# Altium schematic sheet regulater.SchDoc
size A; SheetNumber: 1; SheetTotal: 1
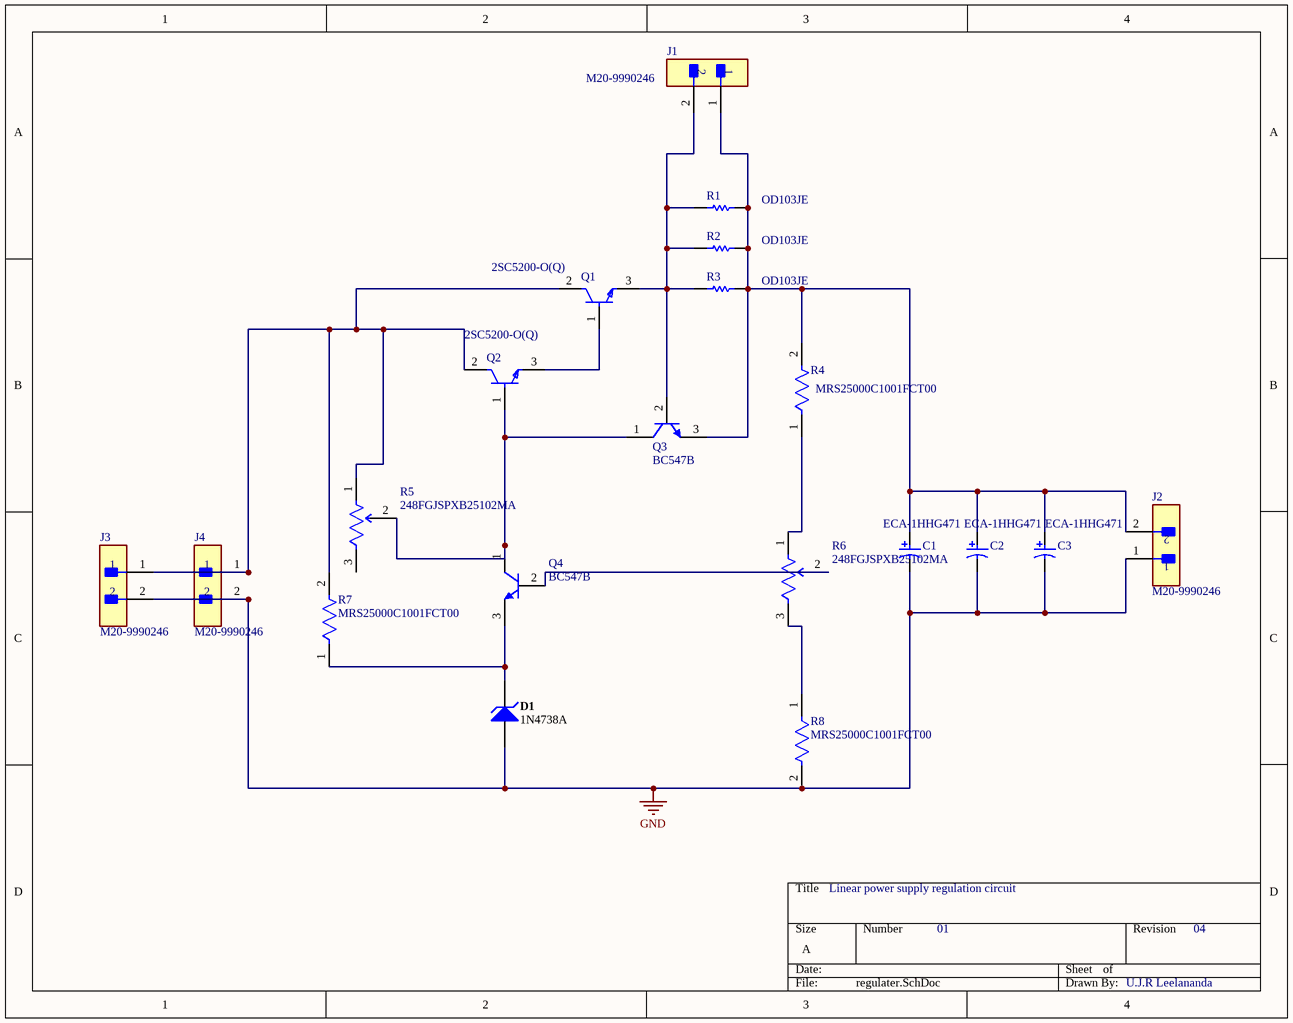
[diagram p0: regulater.SchDoc]

## Parts
C1  ECA-1HHG471  [PNSC-CAP-10x20-P2]
C2  ECA-1HHG471  [PNSC-CAP-10x20-P2]
C3  ECA-1HHG471  [PNSC-CAP-10x20-P2]
D1  1N4738A  [FAIR-DO-41-2_V]
J1  M20-9990246  [FP-M20-9990246-MFG]
J2  M20-9990246  [FP-M20-9990246-MFG]
J3  M20-9990246  [FP-M20-9990246-MFG]
J4  M20-9990246  [FP-M20-9990246-MFG]
Q1  2SC5200-O(Q)  [FP-2-21F1A-MFG]
Q2  2SC5200-O(Q)  [FP-2-21F1A-MFG]
Q3  BC547B  [ONSC-TO-92-3-29-11]
Q4  BC547B  [ONSC-TO-92-3-29-11]
R1  OD103JE  [OMTE-RES7X2.5-2]
R2  OD103JE  [OMTE-RES7X2.5-2]
R3  OD103JE  [OMTE-RES7X2.5-2]
R4  MRS25000C1001FCT00  [FP-MRS25-MFG]
R5  248FGJSPXB25102MA  [FP-248FGJSPXB25102MA-MFG]
R6  248FGJSPXB25102MA  [FP-248FGJSPXB25102MA-MFG]
R7  MRS25000C1001FCT00  [FP-MRS25-MFG]
R8  MRS25000C1001FCT00  [FP-MRS25-MFG]

## Nets
GND: C1.2 C2.2 C3.2 D1.1(A) J2.1 J3.2 J4.2 R8.2
NetC1_1: C1.1 C2.1 C3.1 J1.1 J2.2 Q3.3(E) R1.2 R2.2 R3.2 R4.2
NetD1_2: D1.2(K) Q4.3(E) R7.1
NetJ1_2: J1.2 Q1.3(E) Q3.2(B) R1.1 R2.1 R3.1
NetJ3_1: J3.1 J4.1 Q1.2(C) Q2.2(C) R5.1 R7.2
NetQ1_1: Q1.1(B) Q2.3(E)
NetQ2_1: Q2.1(B) Q3.1(C) Q4.1(C) R5.2(CW)
NetQ4_2: Q4.2(B) R6.2(CW)
NetR4_1: R4.1 R6.1
NetR6_3: R6.3 R8.1

Not connected (* = marked no-connect by the designer): R5 3

## Notes on the sheet
- Linear power supply regulation circuit
- 01
- 04
- U.J.R Leelananda

## Library data of the parts
C1-C3 = CMP-2000-05308-1: Aluminum Electrolytic Capacitor, 470 uF, +/- 20%, 50 V, -55 to 105 degC, 2-Pin THD, RoHS, Bulk; Manufacturer: Panasonic; Package Version: Nov-12; Type: Radial; Lifetime@Temperature: 2000Hrs@105degC; Capacitance: 470µF; Rated Voltage: 50V; Ripple Current: 530mA; Case Size/Dimension: Ø10x20mm; Package Reference: CAP-10x20-P2; Package Description: 2-Pin Through Hole Device, Dia 10 mm, Body Length 20 mm, Pin Spacing 5 mm; Series: NHG; Datasheet Version: Nov-12; Datasheet URL: http://www.alliedelec.com/images/products/datasheets/bm/Panasonic/70067776.pdf; Package URL: http://www.alliedelec.com/images/products/datasheets/bm/Panasonic/70067776.pdf; Operating Temp-Max: 105degC; Operating Temp Range: -55to+105degC; Manufacturer URL: http://www.panasonic.com/
D1 = CMP-0892-00011-1: Zener Diode, 8.2V, 1W, 5%, -65 to 200 degC, 2-Pin DO-41, Body 2.72 x 5.2 mm, RoHS; Manufacturer: Fairchild Semiconductor; VZ (Max.) (V): 8.61; ZZ (Max) (ohm): 4; Test Current IZ (mA): 31; VZ (Min.) (V): 7.79; PD (W): 1; IR (uA): 10; Tolerance: 5%; DatasheetVersion: Rev. H3; ComponentLink1Description: Manufacturer URL; ComponentLink3URL: http://www.fairchildsemi.com/dwg/DO/DO41A.pdf; Operating and Storage Temperature Range: -65 to 200 degC; Mounting Technology: Through Hole; RoHS: TRUE; ComponentLink2URL: http://www.fairchildsemi.com/ds/1N/1N4744A.pdf; PackageDescription: 2-Pin Axial leaded, Body 2.72 x 5.2 mm, Lead Spread 25.4 mm; ComponentLink1URL: http://www.fairchildsemi.com/; ComponentLink3Description: Package Specification; PartNumber: 1N4738A; ComponentLink2Description: Datasheet; PackageReference: DO-41-2; PackageVersion: Rev. 2
J1-J4 = CMP-15831-000009-1: CONN HEADER VERT 2POS 2.54MM; Manufacturer: Harwin; Conn Gender: Male; Conn Orientation: Vertical; Number Of Contacts: 2; Current Rating: 3A; ComponentLink2URL: https://cdn.harwin.com/pdfs/M20-999.pdf; ComponentLink2Description: Datasheet; Package: M20-9990246; Temperature: -40°C to +105°C; Octopart: https://octopart.com/m20-9990246-harwin-2590635; Mouser Description: 2.54mm (0.1") Pitch SIL Vertical PC Tail Pin Header, 6.1mm mating pin height, tin, 2 contacts; Temperature Range High: +105°C; Device Class L1: Connectors; RoHS: TRUE; Automotive: No; Height: 8.99mm; Number Of Rows: 1; Contact Material: Tin,Nickel; Category: Conn; Pitch: 2.54mm; Lead Free: Yes; Digikey Description: CONN HEADER VERT 2POS 2.54MM; Manufacturer Part Number: M20-9990246; Temperature Range Low: -40°C; Device Class L3: unset; Device Class L2: Headers and Wire Housings
Q1 Q2 = CMP-35913-000004-1: TRANS NPN 230V 15A TO-3PL; hFE Min: 80; Number of Elements: 1; Emitter Base Voltage (VEBO): 5V; Transition Frequency: 30MHz; Collector-emitter Voltage-Max: 3V; Max Power Dissipation: 150W; Element Configuration: Single; Polarity: NPN; Radiation Hardening: No; Mount: Through Hole; Collector Emitter Voltage (VCEO): 230V; Collector Base Voltage (VCBO): 230V; Max Collector Current: 15A; Min Operating Temperature: -55°C; Voltage Rating (DC): 230V; Contact Plating: Copper; Lead Free: Lead Free; Packaging: Rail/Tube; Package Quantity: 100; Power Dissipation: 150W; Collector Emitter Breakdown Voltage: 230V; Current Rating: 15A; Frequency: 30MHz; Gain Bandwidth Product: 30MHz; Number of Pins: 3; Max Operating Temperature: 150°C; Series: -
Q3 Q4 = CMP-1048-01467-1: Amplifier Transistor, NPN Silicon, 3-Pin TO-92, Bulk Box; Manufacturer: On Semiconductor; IC Continuous (A): 0.1; fT Min (MHz): 150; DatasheetVersion: Rev. 7; ComponentLink1URL: http://www.onsemi.com/; Polarity: NPN; RoHS: FALSE; ComponentLink1Description: Manufacturer URL; Packing: Bulk Box; PackageDescription: 3-Pin Transistor Outline, Body 4.825 x 3.685 mm, Pitch 1.27 mm; ComponentLink3URL: http://www.onsemi.cn/pub_link/Collateral/2N6426-D.PDF; ComponentLink2Description: Datasheet; PackageVersion: Rev. AM; PackageReference: TO-92-3-29-11_AM_SL; ComponentLink3Description: Package Specification; Mounting Technology: Through Hole; PartNumber: BC547B; ComponentLink2URL: http://www.onsemi.com/pub_link/Collateral/BC546-D.PDF
R1-R3 = CMP-2000-06865-1: Little Demon(R) Carbon Composition Molded OD Series, 250 V, 10 KOhm, +/-5%, -70 to 130 degC, 2-Pin THD, RoHS, Bulk; Manufacturer: Ohmite; Resistance (Ohms): 10k; Power Rating: 0.25W; Power (Watts): 0.25W,1/4W; Tolerance: ±5%; Online Catalog: OD,OF,OASeries,LittleDemon®; Catalog Drawings: OD,OF,OASeries; EDA / CAD Models: DownloadfromAcceleratedDesigns; Mounting Technology: ThroughHole; Datasheet Version: 06/2016; RoHS Information: LittleDemon"E"SeriesMaterialDeclaration; Number of Terminations: 2; Temperature Coefficient: -; Height: -; Composition: CarbonComposition; Package Description: 2-Pin THD Resistor, Body 7 x 2.5 mm, Lead Dia. 0.6 mm; Size / Dimension: 0.098"Diax0.276"L(2.50mmx7.00mm); Category: Resistors; Manufacturer URL: http://www.ohmite.com/; Features: PulseWithstanding; Family: ThroughHoleResistors; PartNumber: OD103JE; Supplier Device Package: Axial; Package / Case: Axial; Standard Package: 100; Package Reference: RES7X2.5; Operating Temperature: -; Series: LittleDemon®OD; Datasheet URL: http://www.ohmite.com/cat/res_od_of_oa.pdf; Packaging: Bulk
R4 R7 R8 = CMP-02408-000051-1: RES 1K OHM 0.6W 1% AXIAL; Power Rating: 600mW; Lead Diameter: 0.6mm; Voltage Rating (DC): 350V; Resistance: 1kR; Temperature Coefficient: 50ppm/°C; Width: 2.5mm; Military Standard: Not; Package Quantity: 5000; Radiation Hardening: No; Case/Package: Axial; Resistance Tolerance: 1%; Resistor Type: Metal Film; Contact Plating: Tin; Length: 6.5mm; Lead Free: Lead Free; RoHS Compliant: Yes; Mount: Through Hole; Number of Pins: 2; Technology: THIN FILM; Voltage Rating: 350V; Min Operating Temperature: -55°C; Weight: 0.00776oz; Diameter: 2.5mm; Construction: Cylindrical; Series: MRS25; Tolerance: 1%; Packaging: Tape and Reel; Max Operating Temperature: 155°C; Max Power Dissipation: 600mW; Number of Terminations: 2; Termination: Axial
R5 R6 = CMP-02410-000007-1: POT PLASTIC LINEAR; Number of Turns: 1; Hole Diameter: 9.525mm; Insulation Resistance: 1GR; Resistance: 1kR; Tolerance: 20%; Temperature Coefficient: 1000ppm/°C; Power Rating: 500mW; Min Operating Temperature: -55°C; Termination: Pin; Mount: Through Hole; Technology: CONDUCTIVE PLASTIC; Max Operating Temperature: 125°C; Military Standard: Not; Length: 30.73mm; Radiation Hardening: No; Depth: 12.7mm; Series: *; Packaging: Bulk; Package Quantity: 50; Height: 13.11mm; RoHS Compliant: Yes; Type: Potentiometer; Resistance Tolerance: 20%; Resistor Type: Potentiometer; Number of Gangs: 1